# EAGLE design Main_PCB (EAGLE 9.0.1)
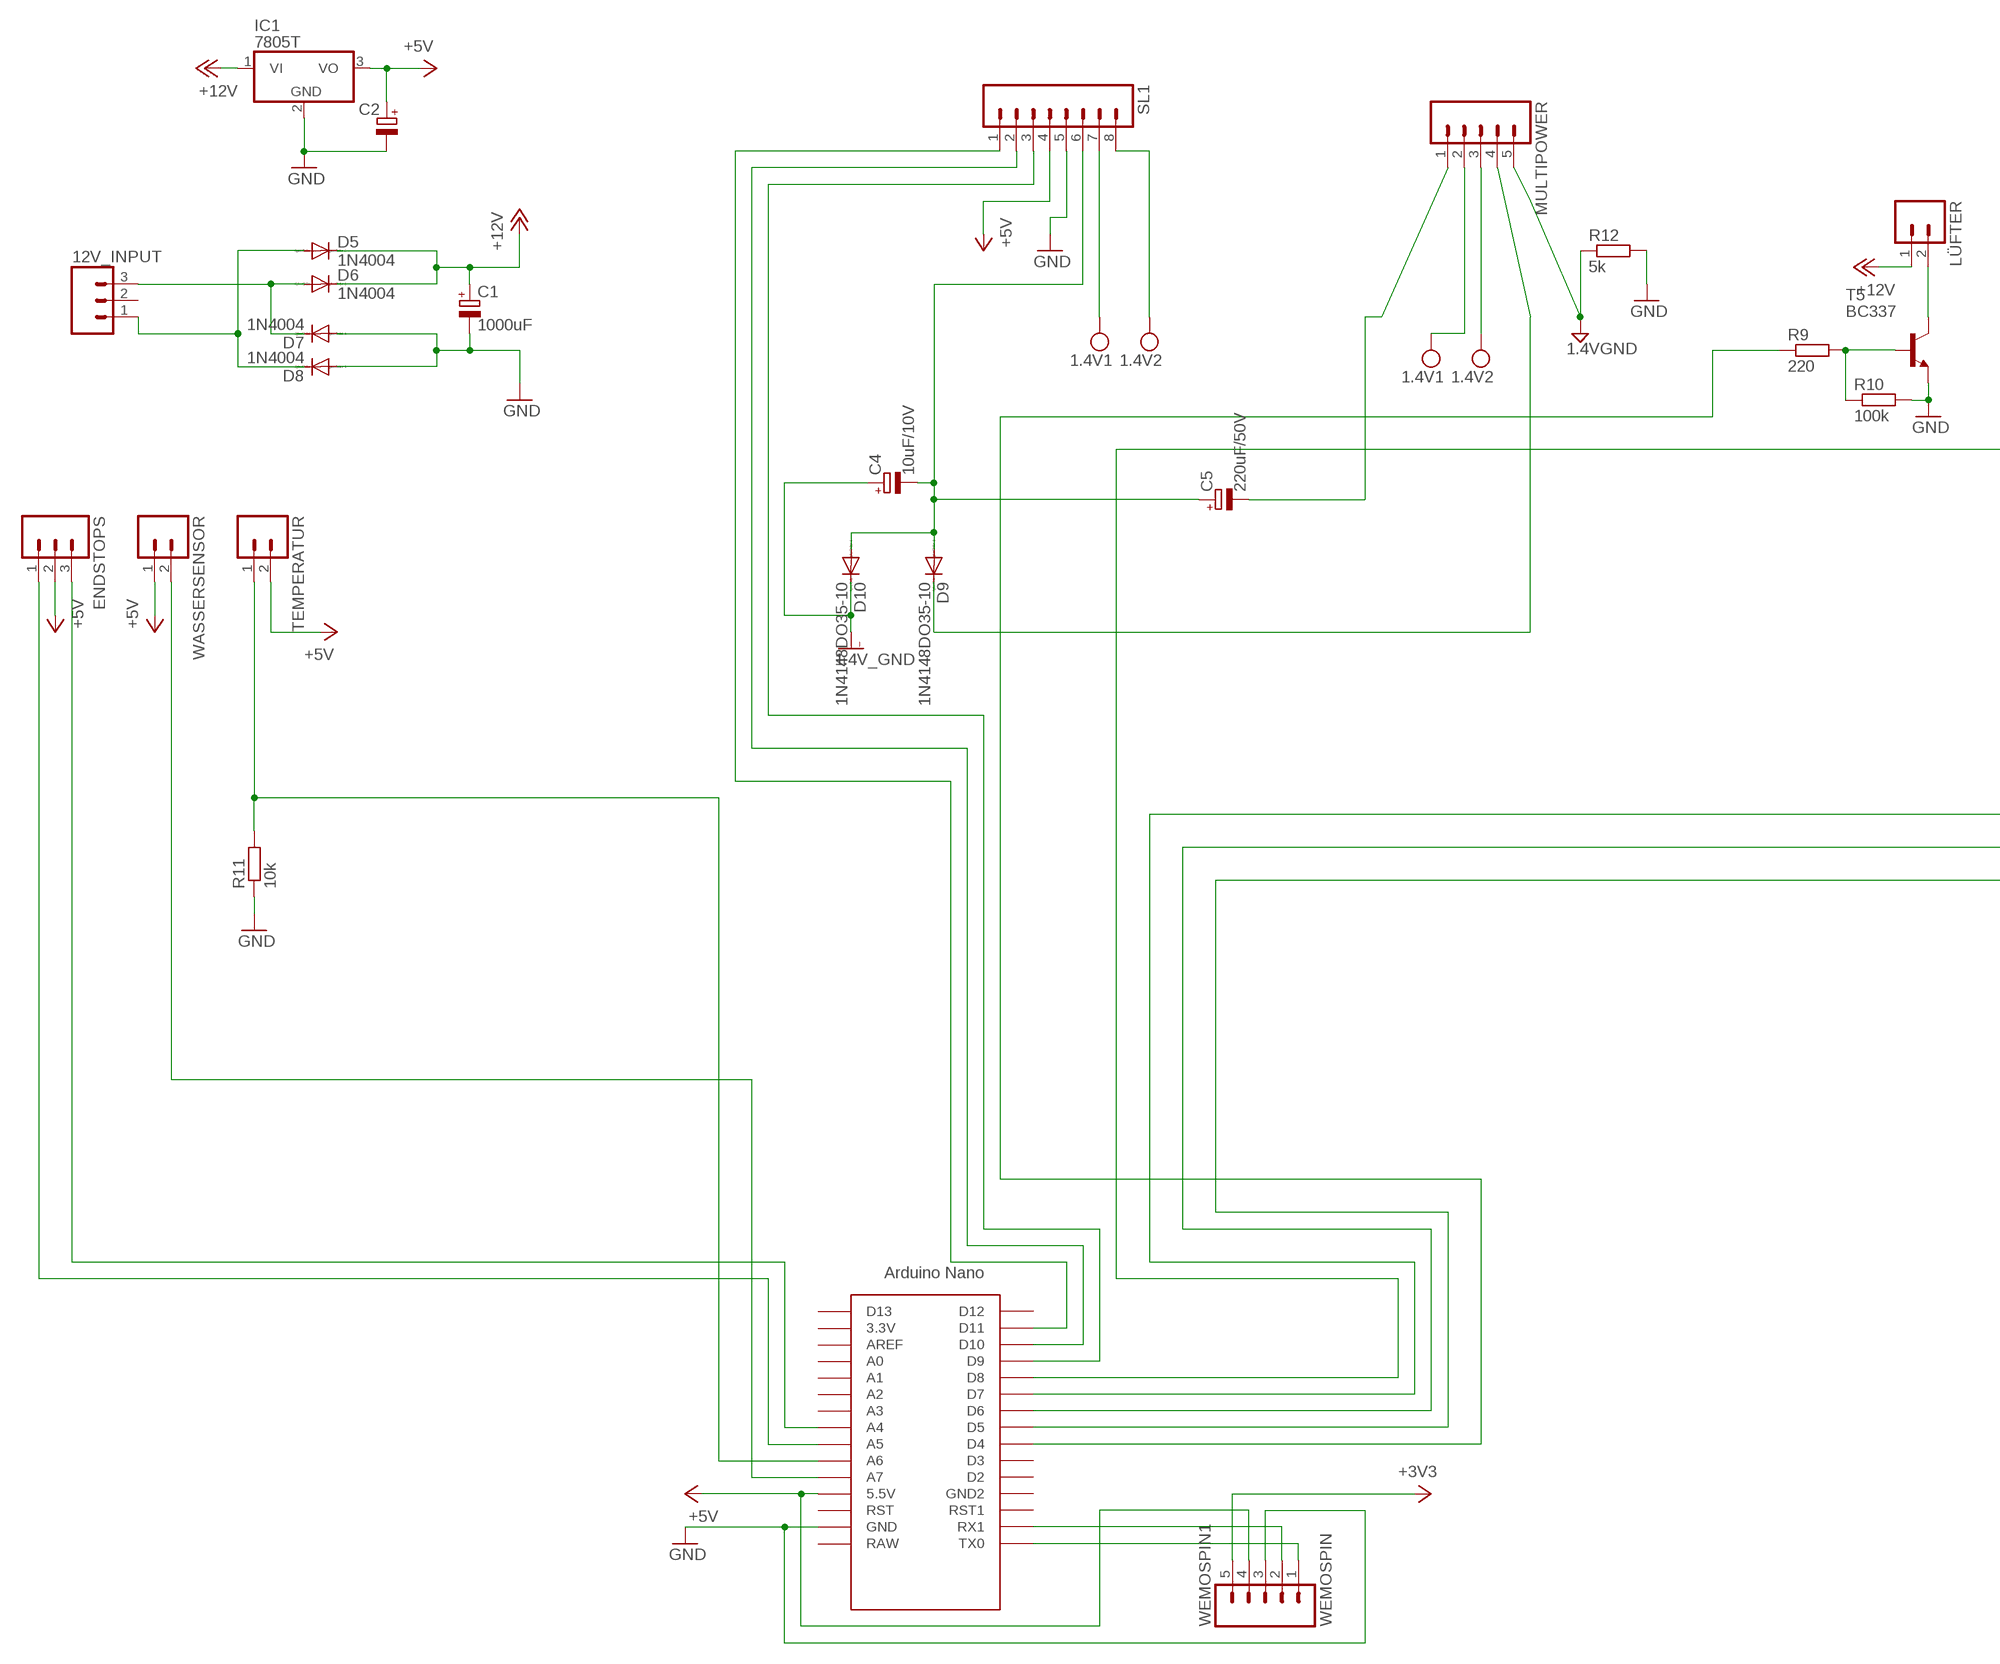
[diagram p0: schematic, sheet 1, part 1 of 2]
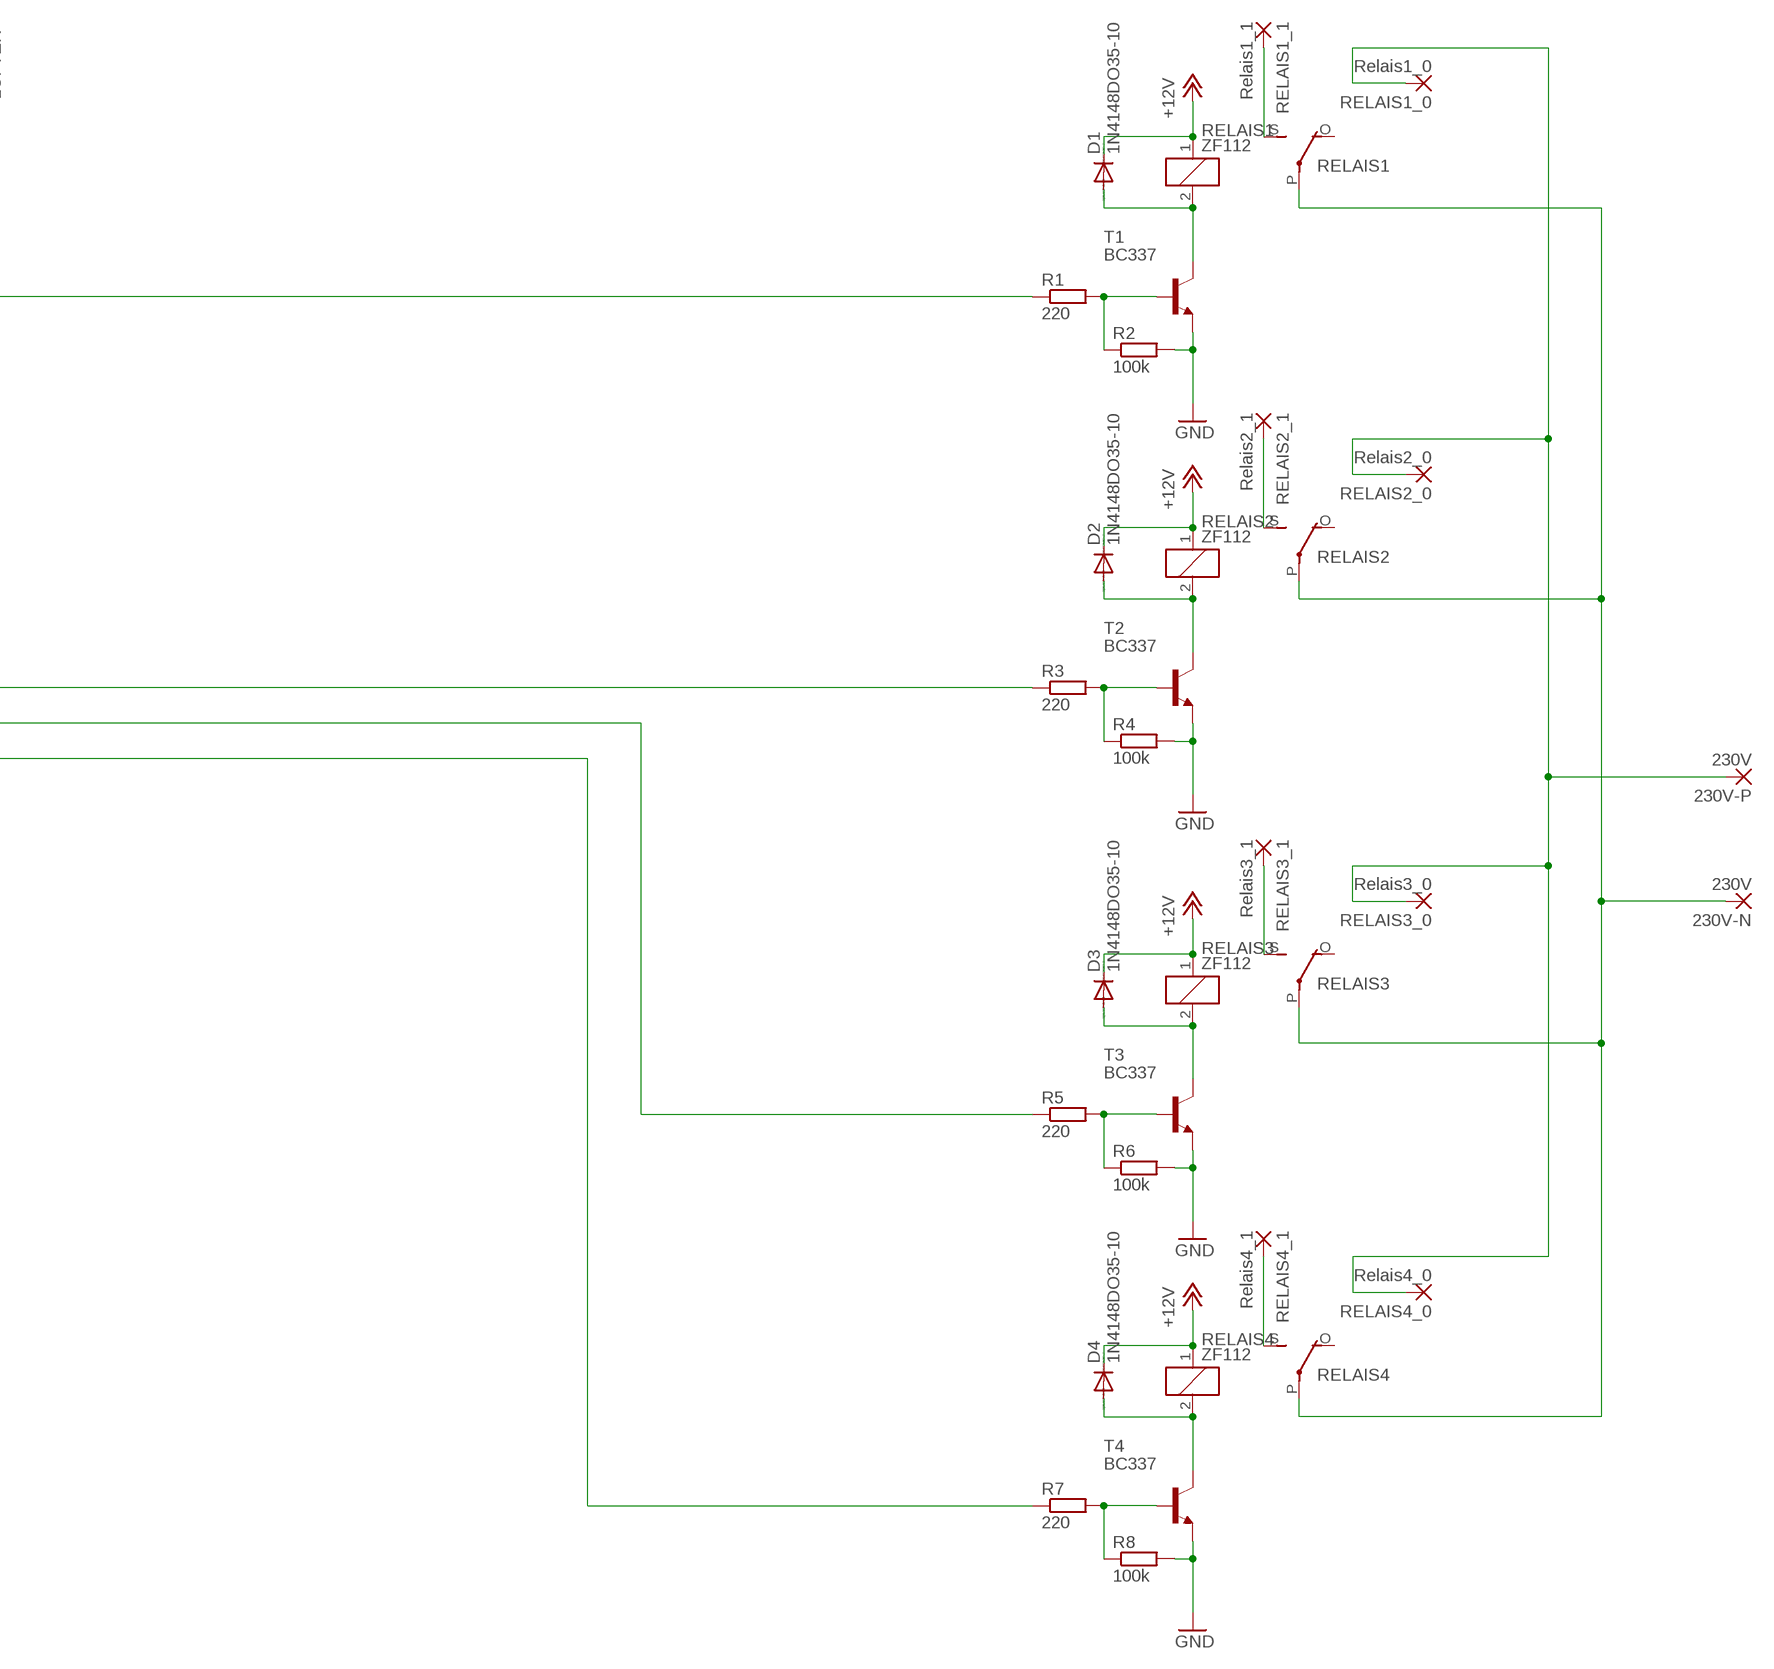
[diagram p1: schematic, sheet 1, part 2 of 2]

## Parts
12V_INPUT  M03  [03P]
230V-N  230V  2,15/1,0  [2,15/1,0]
230V-P  230V  2,15/1,0  [2,15/1,0]
C1  1000uF  CPOL-EUE2.5-5  [E2,5-5]
C2  CPOL-EUE2.5-4V  [E2,5RE]
C4  10uF/10V  CPOL-EUE2.5-4V  [E2,5RE]
C5  220uF/50V  CPOL-EUE2.5-4V  [E2,5RE]
D1  1N4148DO35-10  [DO35-10]
D2  1N4148DO35-10  [DO35-10]
D3  1N4148DO35-10  [DO35-10]
D4  1N4148DO35-10  [DO35-10]
D5  1N4004  [DO41-10]
D6  1N4004  [DO41-10]
D7  1N4004  [DO41-10]
D8  1N4004  [DO41-10]
D9  1N4148DO35-10  [DO35-10]
D10  1N4148DO35-10  [DO35-10]
ENDSTOPS  M03  [03P]
IC1  7805T  [TO220H]
LÜFTER  M02  [02P]
MULTIPOWER  M05  [05P]
R1  220  R-EU_0207/10  [0207/10]
R2  100k  R-EU_0207/10  [0207/10]
R3  220  R-EU_0207/10  [0207/10]
R4  100k  R-EU_0207/10  [0207/10]
R5  220  R-EU_0207/10  [0207/10]
R6  100k  R-EU_0207/10  [0207/10]
R7  220  R-EU_0207/10  [0207/10]
R8  100k  R-EU_0207/10  [0207/10]
R9  220  R-EU_0207/10  [0207/10]
R10  100k  R-EU_0207/10  [0207/10]
R11  10k  R-EU_0207/10  [0207/10]
R12  5k  R-EU_0207/10  [0207/10]
RELAIS1  ZF112  [ZF112]
RELAIS1_0  Relais1_0  2,15/1,0  [2,15/1,0]
RELAIS1_1  Relais1_1  2,15/1,0  [2,15/1,0]
RELAIS2  ZF112  [ZF112]
RELAIS2_0  Relais2_0  2,15/1,0  [2,15/1,0]
RELAIS2_1  Relais2_1  2,15/1,0  [2,15/1,0]
RELAIS3  ZF112  [ZF112]
RELAIS3_0  Relais3_0  2,15/1,0  [2,15/1,0]
RELAIS3_1  Relais3_1  2,15/1,0  [2,15/1,0]
RELAIS4  ZF112  [ZF112]
RELAIS4_0  Relais4_0  2,15/1,0  [2,15/1,0]
RELAIS4_1  Relais4_1  2,15/1,0  [2,15/1,0]
SL1  M08  [08P]
T1  BC337  [TO92]
T2  BC337  [TO92]
T3  BC337  [TO92]
T4  BC337  [TO92]
T5  BC337  [TO92]
TEMPERATUR  M02  [02P]
U$1  NANO  [NANO]
WASSERSENSOR  M02  [02P]
WEMOSPIN1  WEMOSPIN  M05  [05P]

## Nets
+3V3: WEMOSPIN1.5
+5V: C2.+ ENDSTOPS.2 IC1.3(VO) SL1.4 TEMPERATUR.2 U$1.5V(5.5V) WASSERSENSOR.1 WEMOSPIN1.4
+12V: C1.+ D1.C D2.C D3.C D4.C D5.C D6.C IC1.1(VI) LÜFTER.1 RELAIS1.1 RELAIS2.1 RELAIS3.1 RELAIS4.1
GND: C1.- C2.- D7.A D8.A IC1.2(GND) R2.2 R4.2 R6.2 R8.2 R10.2 R11.1 R12.2 SL1.5 T1.1(E) T2.1(E) T3.1(E) T4.1(E) T5.1(E) U$1.GND WEMOSPIN1.3
GND1: MULTIPOWER.5 R12.1 ; supply symbol labelled 1.4VGND
GNDI: C4.+ D10.C ; supply symbol labelled 1.4V_GND
N$1: RELAIS4.S(2:S) RELAIS4_1.1(P)
N$2: D2.A RELAIS2.2 T2.3(C)
N$3: D1.A RELAIS1.2 T1.3(C)
N$4: R1.2 R2.1 T1.2(B)
N$5: RELAIS2.S(2:S) RELAIS2_1.1(P)
N$6: R3.2 R4.1 T2.2(B)
N$7: RELAIS3.S(2:S) RELAIS3_1.1(P)
N$8: D3.A RELAIS3.2 T3.3(C)
N$9: R5.2 R6.1 T3.2(B)
N$10: RELAIS1.S(2:S) RELAIS1_1.1(P)
N$11: D4.A RELAIS4.2 T4.3(C)
N$12: R7.2 R8.1 T4.2(B)
N$13: 230V-P.1(P) RELAIS1_0.1(P) RELAIS2_0.1(P) RELAIS3_0.1(P) RELAIS4_0.1(P)
N$14: R1.1 U$1.D8
N$15: R3.1 U$1.D7
N$16: R5.1 U$1.D6
N$17: R7.1 U$1.D5
N$18: R9.1 U$1.D4
N$19: R11.2 TEMPERATUR.1 U$1.A6
N$21: U$1.A7 WASSERSENSOR.2
N$22: 12V_INPUT.3 D6.A D7.C
N$23: 12V_INPUT.1 D5.A D8.C
N$24: R9.2 R10.1 T5.2(B)
N$25: LÜFTER.2 T5.3(C)
N$26: U$1.RX1 WEMOSPIN1.2
N$27: C4.- C5.+ D9.A D10.A SL1.6
N$28: SL1.3 U$1.D9
N$29: SL1.2 U$1.D10
N$30: SL1.1 U$1.D11
N$31: U$1.TX0 WEMOSPIN1.1
N$32: C5.- MULTIPOWER.1
N$33: D9.C MULTIPOWER.4
N$39: 230V-N.1(P) RELAIS1.P(2:P) RELAIS2.P(2:P) RELAIS3.P(2:P) RELAIS4.P(2:P)
N$41: ENDSTOPS.3 U$1.A4
N$42: ENDSTOPS.1 U$1.A5
VCC: MULTIPOWER.2 SL1.7 ; supply symbol labelled 1.4V1
VDD: MULTIPOWER.3 SL1.8 ; supply symbol labelled 1.4V2
Unconnected: 12V_INPUT.2 RELAIS1.O(2:O) RELAIS2.O(2:O) RELAIS3.O(2:O) RELAIS4.O(2:O) U$1.3.3V U$1.A0 U$1.A1 U$1.A2 U$1.A3 U$1.AREF U$1.D2 U$1.D3 U$1.D12 U$1.D13 U$1.GND1(GND2) U$1.ICSP1 U$1.ICSP2 U$1.ICSP3 U$1.ICSP4 U$1.ICSP5 U$1.ICSP6 U$1.RAW U$1.RST U$1.RST1

## Library data of the parts
12V_INPUT ENDSTOPS = con-amp-quick:M03: AMP QUICK CONNECTOR; OC_FARNELL: unknown; OC_NEWARK: unknown
230V-N 230V-P RELAIS1_0 RELAIS1_1 RELAIS2_0 RELAIS2_1 RELAIS3_0 RELAIS3_1 RELAIS4_0 RELAIS4_1 = wirepad:2,15/1,0: THROUGH-HOLE PAD
C1 C2 C4 C5 = resistor:CPOL-EU: POLARIZED CAPACITOR, European symbol
D1-D4 D9 D10 = diode:1N4148: DIODE high speed (Philips)
D5-D8 = diode:1N4004: DIODE general purpose rectifier, 1 A
IC1 = linear:78*: Positive VOLTAGE REGULATOR Source: http://cache.national.com/ds/LM/LM78L05.pdf http://www.fairchildsemi.com/ds/LM/LM7805.pdf
LÜFTER TEMPERATUR WASSERSENSOR = con-amp-quick:M02: AMP QUICK CONNECTOR; OC_FARNELL: unknown; OC_NEWARK: unknown
MULTIPOWER WEMOSPIN1 = con-amp-quick:M05: AMP QUICK CONNECTOR; OC_FARNELL: unknown; OC_NEWARK: unknown
R1-R12 = resistor:R-EU_: RESISTOR, European symbol
RELAIS1-RELAIS4 = relay:ZF112: RELAY 1 x switch; OC_FARNELL: unknown; OC_NEWARK: unknown
SL1 = con-amp-quick:M08: AMP QUICK CONNECTOR; OC_FARNELL: unknown; OC_NEWARK: unknown
T1-T5 = transistor:BC337: NPN TRANSISTOR
U$1 = Arduino-clone:NANO: Arduino Nano

## Board
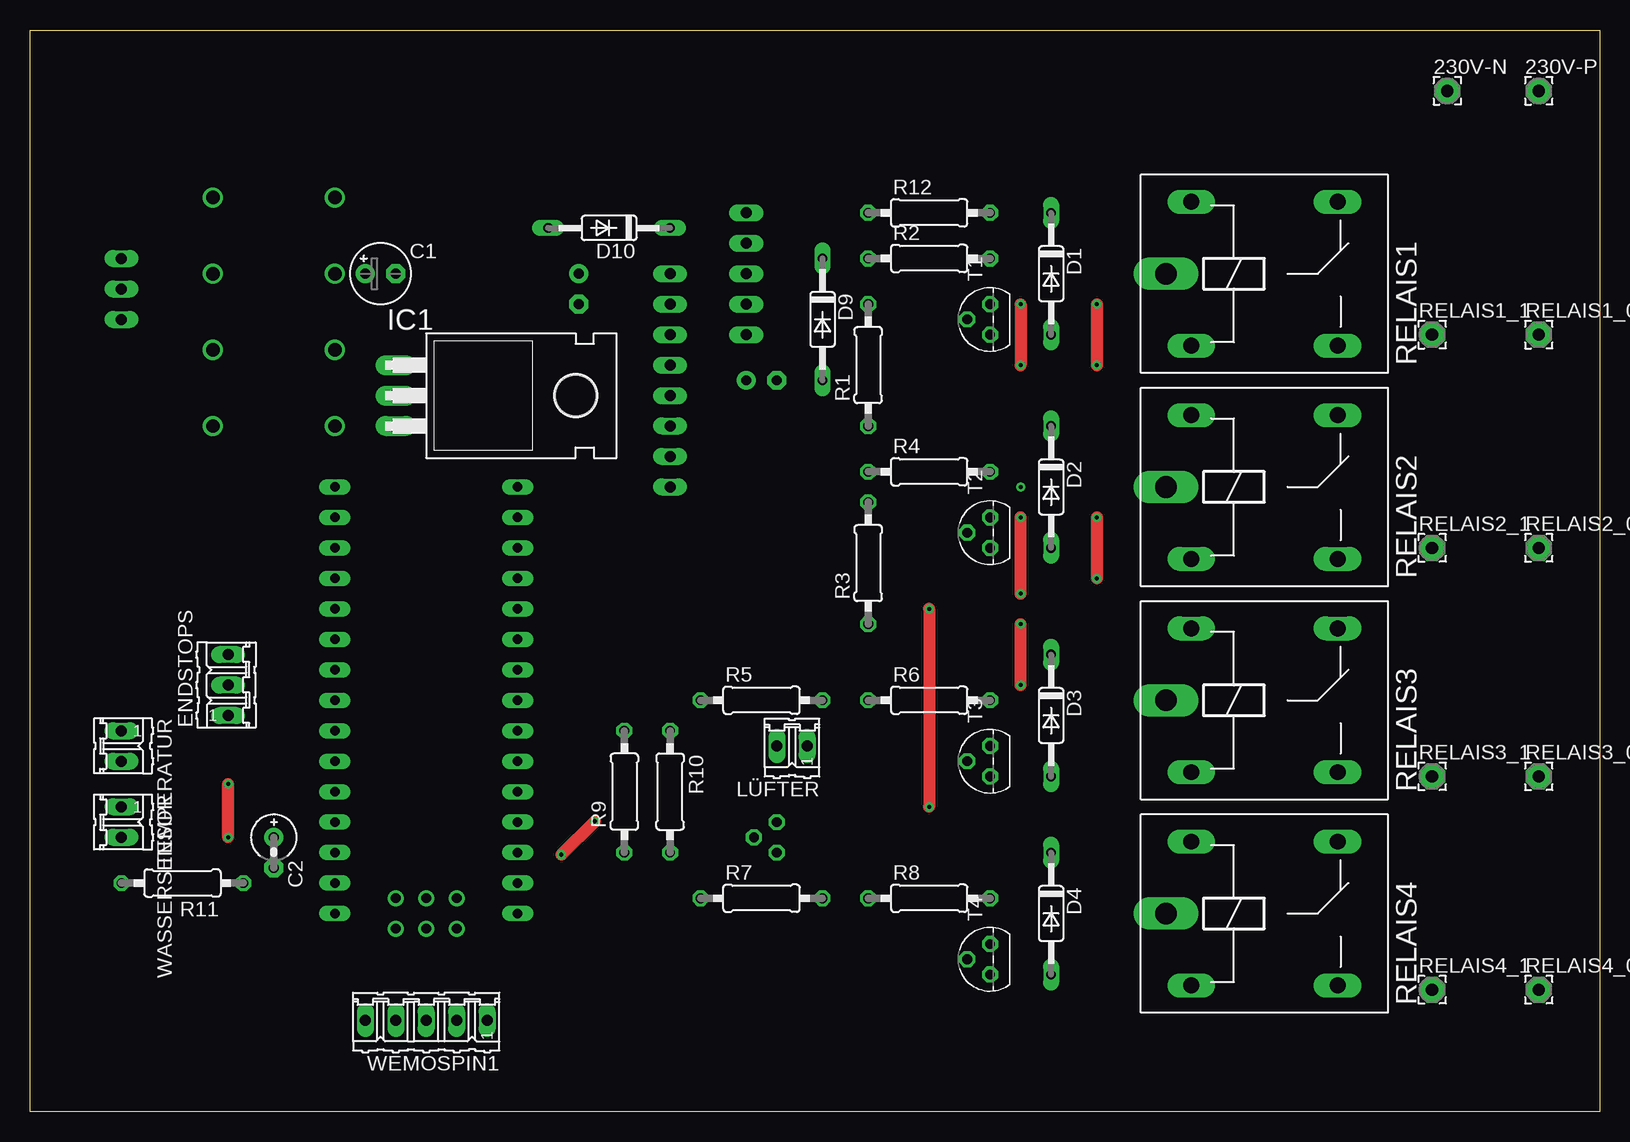
[diagram p2: board, top side]
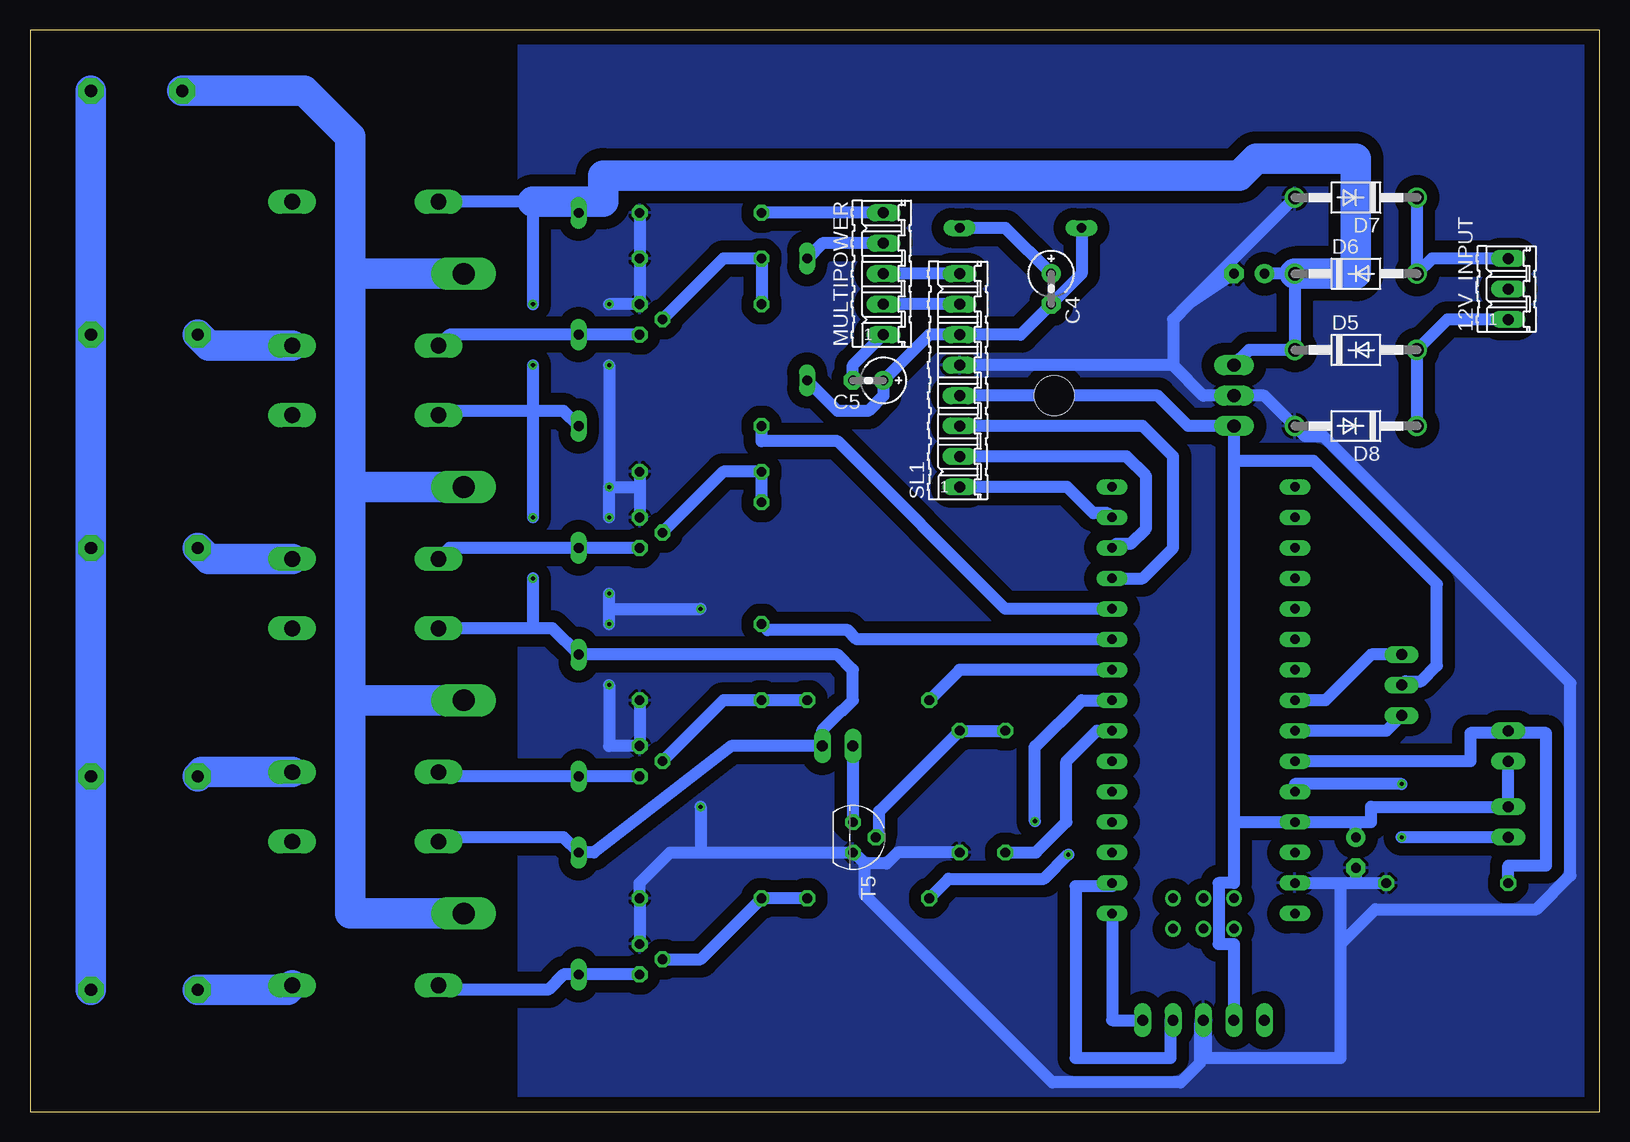
[diagram p3: board, bottom side, seen from below]

Size 130.81 x 90.17 mm. Coordinates in mm from the lower left corner, seen from the top.
Outline: 0,90.17 130.81,90.17 130.81,0 0,0 0,90.17
Copper layers (1*16): Top 0.035mm / dielectric 1.5mm / Bottom 0.035mm
Design rules "default *": minimum track width 40mil, minimum drill 0.35mm, track to track 40mil, track to pad 40mil, pad to pad 40mil, via to via 40mil, smd to smd 6mil, copper to edge 40mil, drill to drill 6mil, minimum pad ring 10mil, minimum via ring 8mil, stop-mask expansion 4mil, vias tented up to drill 0mil, thermal gap 10mil

### Footprints (pad centres in the part's own frame; a part is rotated, then mirrored left to right if it is on the bottom)
03P = drill 0.914 long: 1 -2.54,0; 2 0,0; 3 2.54,0
2,15/1,0 = drill 1.016 pad 2.159 octagon: 1 0,0
E2,5-5 = drill 0.813 pad 1.6: + -1.27,0 | drill 0.813 pad 1.6 octagon: - 1.27,0
E2,5RE = drill 0.813 pad 1.575: + -1.27,0 | drill 0.813 pad 1.575 octagon: - 1.27,0
DO35-10 = drill 0.813 long: A 5.08,0; C -5.08,0
DO41-10 = drill 1.118: A 5.08,0; C -5.08,0
TO220H = drill 1.118 long: 1 -2.54,-10.16; 2 0,-10.16; 3 2.54,-10.16 | hole 3.302: 0,4.826
02P = drill 0.914 long: 1 -1.27,0; 2 1.27,0
05P = drill 0.914 long: 1 -5.08,0; 2 -2.54,0; 3 0,0; 4 2.54,0; 5 5.08,0
0207/10 = drill 0.813 octagon: 1 -5.08,0; 2 5.08,0
ZF112 = drill 1.321 long: 1 -6.096,5.994; 2 -6.096,-5.994; O 6.096,5.994; S 6.096,-5.994 | drill 1.803 long: P -8.204,0
08P = drill 0.914 long: 1 -8.89,0; 2 -6.35,0; 3 -3.81,0; 4 -1.27,0; 5 1.27,0; 6 3.81,0; 7 6.35,0; 8 8.89,0
TO92 = drill 0.813 octagon: 1 1.27,0; 2 0,1.905; 3 -1.27,0
NANO = drill 0.8 long: 3.3V -10.16,24.13; 5V -10.16,-1.27; A0 -10.16,19.05; A1 -10.16,16.51; A2 -10.16,13.97; A3 -10.16,11.43; A4 -10.16,8.89; A5 -10.16,6.35; A6 -10.16,3.81; A7 -10.16,1.27; AREF -10.16,21.59; D2 5.08,1.27; D3 5.08,3.81; D4 5.08,6.35; D5 5.08,8.89; D6 5.08,11.43; D7 5.08,13.97; D8 5.08,16.51; D9 5.08,19.05; D10 5.08,21.59; D11 5.08,24.13; D12 5.08,26.67; D13 -10.16,26.67; GND -10.16,-6.35; GND1 5.08,-1.27; RAW -10.16,-8.89; RST -10.16,-3.81; RST1 5.08,-3.81; RX1 5.08,-6.35; TX0 5.08,-8.89 | drill 0.8: ICSP1 -5.08,-10.16; ICSP2 -5.08,-7.62; ICSP3 -2.54,-10.16; ICSP4 -2.54,-7.62; ICSP5 0,-10.16; ICSP6 0,-7.62

### Placement (x,y rotation side)
12V_INPUT  7.62,68.58 90 bottom
230V-N  118.11,85.09 0 top
230V-P  125.73,85.09 0 top
C1  29.21,69.85 0 top
C2  20.32,21.59 270 top
C4  45.72,68.58 270 bottom
C5  60.96,60.96 180 bottom
D1  85.09,69.85 270 top
D2  85.09,52.07 270 top
D3  85.09,33.02 270 top
D4  85.09,16.51 270 top
D5  20.32,63.5 0 bottom
D6  20.32,69.85 0 bottom
D7  20.32,76.2 180 bottom
D8  20.32,57.15 180 bottom
D9  66.04,66.04 270 top
D10  48.26,73.66 180 top
ENDSTOPS  16.51,35.56 90 top
IC1  40.64,59.69 270 top
LÜFTER  63.5,30.48 180 top
MULTIPOWER  59.69,69.85 90 bottom
R1  69.85,62.23 90 top
R2  74.93,71.12 0 top
R3  69.85,45.72 90 top
R4  74.93,53.34 0 top
R5  60.96,34.29 0 top
R6  74.93,34.29 0 top
R7  60.96,17.78 0 top
R8  74.93,17.78 0 top
R9  49.53,26.67 90 top
R10  53.34,26.67 270 top
R11  12.7,19.05 180 top
R12  74.93,74.93 0 top
RELAIS1  102.87,69.85 0 top
RELAIS1_0  125.73,64.77 0 top
RELAIS1_1  116.84,64.77 0 top
RELAIS2  102.87,52.07 0 top
RELAIS2_0  125.73,46.99 0 top
RELAIS2_1  116.84,46.99 0 top
RELAIS3  102.87,34.29 0 top
RELAIS3_0  125.73,27.94 0 top
RELAIS3_1  116.84,27.94 0 top
RELAIS4  102.87,16.51 0 top
RELAIS4_0  125.73,10.16 0 top
RELAIS4_1  116.84,10.16 0 top
SL1  53.34,60.96 90 bottom
T1  80.01,66.04 90 top
T2  80.01,48.26 90 top
T3  80.01,29.21 90 top
T4  80.01,12.7 90 top
T5  62.23,22.86 270 bottom
TEMPERATUR  7.62,30.48 270 top
U$1  35.56,25.4 0 top
WASSERSENSOR  7.62,24.13 270 top
WEMOSPIN1  33.02,7.62 180 top

### Tracks (layer width: path | path; a pad name or v marks a point on that pad's centre or on a via)
+5V
  Bottom 1.016: 30.48,24.13 U$1.5V 20.32,24.13 | WEMOSPIN1.4 30.48,13.97 31.75,13.97 31.75,19.05 30.48,19.05 30.48,24.13 | 30.48,54.61 IC1.3 34.29,57.15 36.83,59.69 SL1.4 | 30.48,54.61 30.48,24.13 | 20.32,24.13 19.05,24.13 19.05,25.4 WASSERSENSOR.1 TEMPERATUR.2 | C2.+ 20.32,24.13 | ENDSTOPS.2 16.21,35.87 14.87,35.87 13.56,37.17 13.56,43.97 23.84,54.25 30.12,54.25 30.48,54.61
+12V  (via drill 0.35)
  Top 1.016: v88.9,67.31 v88.9,62.23 | v88.9,49.53 v88.9,44.45
  Bottom 1.016: D1.C 86,75.84 88.9,75.84 | 88.9,75.84 RELAIS1.1 | D2.C 86.36,58.42 88.9,58.42 | 88.9,58.42 96.42,58.42 RELAIS2.1 | 88.9,40.28 87.27,40.28 D3.C 63.5,38.1 62.23,36.83 62.23,34.29 63.09,33.43 63.16,33.43 64.77,31.81 LÜFTER.1 72.39,30.48 83.82,21.59 D4.C 86.36,22.86 96.42,22.86 RELAIS4.1 | 88.9,40.28 RELAIS3.1 | IC1.1 29.21,63.5 D5.C D6.C C1.+ | 88.9,75.84 v88.9,67.31 | v88.9,62.23 88.9,58.42 | 88.9,58.42 v88.9,49.53 | v88.9,44.45 88.9,40.28
  Bottom 2.54: 88.9,75.84 83.06,75.84 83.06,78.03 30.02,78.03 28.63,79.43 20.32,79.43 20.32,69.85 D6.C
GND  (via drill 0.35)
  Top 1.016: v82.55,67.31 v82.55,62.23 | v82.55,35.56 v82.55,40.64 | v82.55,43.18 v82.55,49.53 | v74.93,41.91 v74.93,25.4
  Bottom 1.016: T4.1 R8.2 80.01,19.05 77.47,21.59 74.93,21.59 | R6.2 T3.1 82.55,30.48 v82.55,35.56 | R4.2 80.01,52.07 | 80.01,52.07 T2.1 | R12.2 R2.2 T1.1 v82.55,67.31 | 74.93,21.59 T5.1 62.14,21.59 61.23,20.68 | R10.2 58.51,21.59 59.42,20.68 61.23,20.68 | U$1.GND 21.59,19.05 | 21.59,19.05 20.32,19.05 | 20.32,19.05 R11.1 | 21.59,13.97 21.59,4.47 32.82,4.47 32.82,7.62 WEMOSPIN1.3 33.33,7.31 33.33,4.04 34.92,2.44 45.62,2.44 61.23,18.05 61.23,20.68 | 21.59,13.97 21.59,19.05 | v82.55,52.07 80.01,52.07 | 35.56,62.23 SL1.5 | 35.56,62.23 33.02,59.69 IC1.2 27.94,59.69 D8.A 24.53,56.28 23,56.28 2.44,35.72 2.44,19.68 5.25,16.87 18.69,16.87 21.59,13.97 | D7.A 34.29,67.31 | 34.29,67.31 35.56,66.04 35.56,62.23 | v82.55,62.23 v82.55,52.07 | C1.- 34.29,67.31 | C2.- 20.32,19.05 | v82.55,40.64 82.55,41.91 | 82.55,41.91 v82.55,43.18 | v82.55,49.53 v82.55,52.07 | 82.55,41.91 v74.93,41.91 | v74.93,25.4 74.93,21.59
  pour Bottom: 1.27,88.9 90.17,88.9 90.17,1.27 1.27,1.27
GND1
  Bottom 1.016: MULTIPOWER.5 R12.1
GNDI
  Bottom 1.016: C4.+ 49.53,73.66 D10.C
N$1
  Bottom 2.54: RELAIS4_1.1 109.32,10.16 RELAIS4.S
N$2
  Bottom 1.016: RELAIS2.2 95.86,46.99 D2.A T2.3
N$3
  Bottom 1.016: RELAIS1.2 95.86,64.77 D1.A T1.3
N$4
  Bottom 1.016: T1.2 73.03,71.12 R2.1 R1.2
N$5
  Bottom 2.54: RELAIS2.S 115.93,46.08 RELAIS2_1.1
N$6
  Bottom 1.016: T2.2 73.03,53.34 R4.1 R3.2
N$7
  Bottom 2.54: RELAIS3.S 116.48,28.3 RELAIS3_1.1
N$8
  Bottom 1.016: T3.3 D3.A 96.42,27.94 RELAIS3.2
N$9
  Bottom 1.016: R5.2 R6.1 73.03,34.29 T3.2
N$10
  Bottom 2.54: RELAIS1.S 115.93,63.86 RELAIS1_1.1
N$11
  Bottom 1.016: RELAIS4.2 96.42,10.16 87.63,10.16 86.36,11.43 D4.A T4.3
N$12
  Bottom 1.016: R7.2 R8.1 74.93,12.7 T4.2
N$13
  Bottom 2.54: 230V-P.1 RELAIS1_0.1 RELAIS2_0.1 RELAIS3_0.1 RELAIS4_0.1
N$14
  Bottom 1.016: U$1.D8 49.53,41.91 63.5,55.88 69.85,55.88 R1.1
N$15
  Bottom 1.016: U$1.D7 61.9,39.37 62.66,40.13 69.34,40.13 R3.1
N$16
  Bottom 1.016: U$1.D6 53.34,36.83 R5.1
N$17  (via drill 0.35)
  Top 1.016: v44.28,21.42 v47.06,24.2
  Bottom 1.016: R7.1 54.25,19.41 46.3,19.41 v44.28,21.42 | v47.06,24.2 47.06,30.48 46.99,30.48 43.18,34.29 U$1.D5
N$18
  Bottom 1.016: R9.1 46.99,21.59 44.45,24.13 44.45,29.21 41.91,31.75 U$1.D4
N$19
  Bottom 1.016: TEMPERATUR.1 7.62,31.55 | 7.62,31.55 10.77,31.55 10.77,29.21 U$1.A6 | R11.2 7.62,20.52 4.47,20.52 4.47,31.55 7.62,31.55
N$21  (via drill 0.35)
  Top 1.016: v16.51,22.86 v16.51,27.31
  Bottom 1.016: WASSERSENSOR.2 v16.51,22.86 | v16.51,27.31 25.4,27.31 U$1.A7
N$22
  Bottom 1.016: 12V_INPUT.3 13.97,71.12 D6.A D7.C
N$23
  Bottom 1.016: 12V_INPUT.1 12.7,66.04 D5.A D8.C
N$24
  Bottom 1.016: T5.2 60.33,22.95 60.05,23.23 60.05,25.04 R10.1 R9.2
N$25
  Bottom 1.016: LÜFTER.2 T5.3
N$26
  Bottom 1.016: U$1.RX1 40.64,18.79 43.67,18.79 43.67,4.47 35.76,4.47 35.76,7.62 WEMOSPIN1.2
N$27
  Bottom 1.016: D10.A 43.18,69.85 C4.- 48.26,64.77 SL1.6 55.88,64.77 C5.+ 59.69,59.69 60.96,58.42 63.5,58.42 D9.A
N$28
  Bottom 1.016: U$1.D9 38.1,44.45 35.56,46.99 35.56,54.61 38.1,57.15 SL1.3
N$29
  Bottom 1.016: U$1.D10 40.28,47.35 39.08,47.35 37.81,48.63 37.81,52.97 39.45,54.61 SL1.2
N$30
  Bottom 1.016: U$1.D11 41,49.89 42.2,49.89 44.37,52.07 SL1.1
N$31
  Bottom 1.016: U$1.TX0 40.64,7.62 WEMOSPIN1.1
N$32
  Bottom 1.016: C5.- 62.23,62.23 MULTIPOWER.1
N$33
  Bottom 1.016: MULTIPOWER.4 64.77,72.39 D9.C
N$39
  Bottom 2.54: RELAIS1.P 104.14,69.85 | 104.14,52.07 104.14,69.85 | RELAIS2.P 104.14,52.07 | 104.14,34.29 104.14,16.51 RELAIS4.P | 104.14,34.29 104.14,52.07 | RELAIS3.P 104.14,34.29 | 104.14,69.85 104.14,81.28 107.95,85.09 230V-N.1
N$41
  Bottom 1.016: ENDSTOPS.3 19.05,38.1 22.86,34.29 U$1.A4
N$42
  Bottom 1.016: ENDSTOPS.1 17.78,31.75 U$1.A5
VCC
  Bottom 1.016: SL1.7 MULTIPOWER.2
VDD
  Bottom 1.016: SL1.8 MULTIPOWER.3